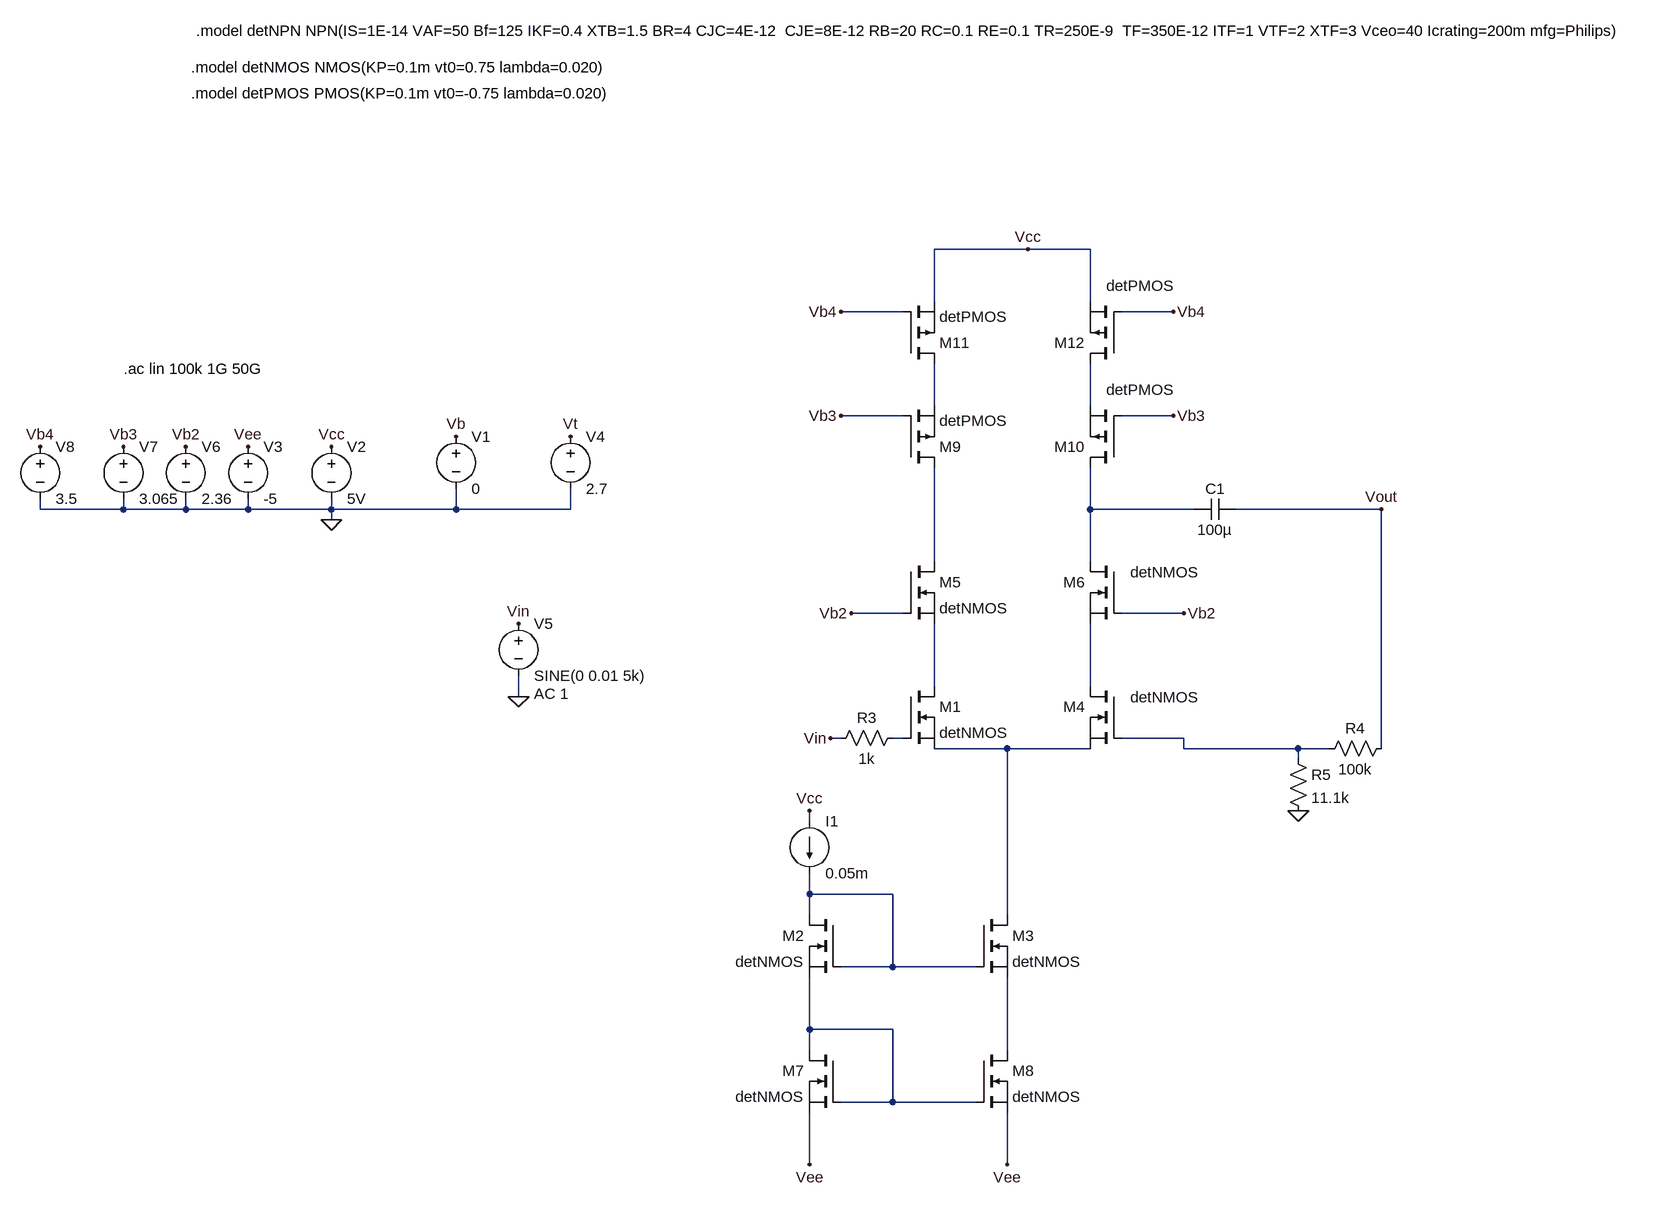
[diagram p0: schematic MOSFETamp.asc]
MOSFETamp.asc, the LTspice schematic file:
Version 4
SHEET 1 1520 2536
WIRE 272 1040 128 1040
WIRE 368 1040 272 1040
WIRE 128 1120 128 1040
WIRE 368 1120 368 1040
WIRE 80 1136 -16 1136
WIRE 496 1136 416 1136
WIRE 128 1280 128 1216
WIRE 368 1280 368 1216
WIRE 80 1296 -16 1296
WIRE 496 1296 416 1296
WIRE -1248 1440 -1248 1424
WIRE -1120 1440 -1120 1424
WIRE -1120 1440 -1248 1440
WIRE -1024 1440 -1024 1424
WIRE -1024 1440 -1120 1440
WIRE -928 1440 -928 1424
WIRE -928 1440 -1024 1440
WIRE -800 1440 -800 1424
WIRE -800 1440 -928 1440
WIRE -608 1440 -608 1408
WIRE -608 1440 -800 1440
WIRE -432 1440 -432 1408
WIRE -432 1440 -608 1440
WIRE 368 1440 368 1376
WIRE 528 1440 368 1440
WIRE 816 1440 592 1440
WIRE -800 1456 -800 1440
WIRE 128 1520 128 1376
WIRE 368 1520 368 1440
WIRE 80 1600 0 1600
WIRE 512 1600 416 1600
WIRE 128 1712 128 1616
WIRE 368 1712 368 1616
WIRE -512 1728 -512 1696
WIRE -16 1792 -32 1792
WIRE 80 1792 64 1792
WIRE 512 1792 416 1792
WIRE 240 1808 128 1808
WIRE 368 1808 240 1808
WIRE 512 1808 512 1792
WIRE 688 1808 512 1808
WIRE 736 1808 688 1808
WIRE 816 1808 816 1440
WIRE 688 1824 688 1808
WIRE -64 1920 -64 1904
WIRE -64 2032 -64 2000
WIRE 64 2032 -64 2032
WIRE -64 2064 -64 2032
WIRE 240 2064 240 1808
WIRE 64 2144 64 2032
WIRE 64 2144 -16 2144
WIRE 192 2144 64 2144
WIRE -64 2240 -64 2160
WIRE 64 2240 -64 2240
WIRE -64 2272 -64 2240
WIRE 240 2272 240 2160
WIRE 64 2352 64 2240
WIRE 64 2352 -16 2352
WIRE 192 2352 64 2352
WIRE -64 2448 -64 2368
WIRE 240 2448 240 2368
FLAG -800 1456 0
FLAG -800 1344 Vcc
FLAG -928 1344 Vee
FLAG -608 1328 Vb
FLAG -64 1904 Vcc
FLAG -432 1328 Vt
FLAG -512 1728 0
FLAG -512 1616 Vin
FLAG 240 2448 Vee
FLAG -64 2448 Vee
FLAG -32 1792 Vin
FLAG 512 1600 Vb2
FLAG 0 1600 Vb2
FLAG -1024 1344 Vb2
FLAG 272 1040 Vcc
FLAG -1120 1344 Vb3
FLAG 496 1296 Vb3
FLAG -16 1296 Vb3
FLAG 496 1136 Vb4
FLAG -16 1136 Vb4
FLAG -1248 1344 Vb4
FLAG 816 1440 Vout
FLAG 688 1904 0
SYMBOL voltage -800 1328 R0
WINDOW 123 0 0 Left 0
WINDOW 39 0 0 Left 0
SYMATTR InstName V2
SYMATTR Value 5V
SYMBOL voltage -928 1328 R0
WINDOW 123 0 0 Left 0
WINDOW 39 0 0 Left 0
SYMATTR InstName V3
SYMATTR Value -5
SYMBOL nmos -16 2064 M0
SYMATTR InstName M2
SYMATTR Value detNMOS
SYMBOL nmos 192 2064 R0
SYMATTR InstName M3
SYMATTR Value detNMOS
SYMBOL nmos 80 1712 R0
SYMATTR InstName M1
SYMATTR Value detNMOS
SYMBOL nmos 416 1712 M0
WINDOW 3 -119 17 Left 2
SYMATTR Value detNMOS
SYMATTR InstName M4
SYMBOL voltage -608 1312 R0
WINDOW 123 0 0 Left 0
WINDOW 39 0 0 Left 0
SYMATTR InstName V1
SYMATTR Value 0
SYMBOL voltage -432 1312 R0
WINDOW 123 0 0 Left 0
WINDOW 39 0 0 Left 0
SYMATTR InstName V4
SYMATTR Value 2.7
SYMBOL voltage -512 1600 R0
WINDOW 123 24 124 Left 2
WINDOW 39 0 0 Left 0
SYMATTR Value2 AC 1
SYMATTR InstName V5
SYMATTR Value SINE(0 0.01 5k)
SYMBOL nmos -16 2272 M0
SYMATTR InstName M7
SYMATTR Value detNMOS
SYMBOL nmos 192 2272 R0
SYMATTR InstName M8
SYMATTR Value detNMOS
SYMBOL current -64 1920 R0
WINDOW 123 0 0 Left 0
WINDOW 39 0 0 Left 0
SYMATTR InstName I1
SYMATTR Value 0.05m
SYMBOL nmos 80 1520 R0
SYMATTR InstName M5
SYMATTR Value detNMOS
SYMBOL nmos 416 1520 M0
WINDOW 3 -119 17 Left 2
SYMATTR Value detNMOS
SYMATTR InstName M6
SYMBOL voltage -1024 1328 R0
WINDOW 123 0 0 Left 0
WINDOW 39 0 0 Left 0
SYMATTR InstName V6
SYMATTR Value 2.36
SYMBOL pmos 80 1376 M180
SYMATTR InstName M9
SYMATTR Value detPMOS
SYMBOL pmos 416 1376 R180
WINDOW 3 -81 120 Left 2
SYMATTR Value detPMOS
SYMATTR InstName M10
SYMBOL voltage -1120 1328 R0
WINDOW 123 0 0 Left 0
WINDOW 39 0 0 Left 0
SYMATTR InstName V7
SYMATTR Value 3.065
SYMBOL pmos 80 1216 M180
SYMATTR InstName M11
SYMATTR Value detPMOS
SYMBOL pmos 416 1216 R180
WINDOW 3 -81 120 Left 2
SYMATTR Value detPMOS
SYMATTR InstName M12
SYMBOL voltage -1248 1328 R0
WINDOW 123 0 0 Left 0
WINDOW 39 0 0 Left 0
SYMATTR InstName V8
SYMATTR Value 3.5
SYMBOL res 80 1776 R90
WINDOW 0 0 56 VBottom 2
WINDOW 3 32 56 VTop 2
SYMATTR InstName R3
SYMATTR Value 1k
SYMBOL res 832 1792 R90
WINDOW 0 0 56 VBottom 2
WINDOW 3 32 56 VTop 2
SYMATTR InstName R4
SYMATTR Value 100k
SYMBOL res 672 1808 R0
SYMATTR InstName R5
SYMATTR Value 11.1k
SYMBOL cap 592 1424 R90
WINDOW 0 0 32 VBottom 2
WINDOW 3 32 32 VTop 2
SYMATTR InstName C1
SYMATTR Value 100µ
TEXT -1008 704 Left 2 !.model detNPN NPN(IS=1E-14 VAF=50 Bf=125 IKF=0.4 XTB=1.5 BR=4 CJC=4E-12  CJE=8E-12 RB=20 RC=0.1 RE=0.1 TR=250E-9  TF=350E-12 ITF=1 VTF=2 XTF=3 Vceo=40 Icrating=200m mfg=Philips)
TEXT -1016 760 Left 2 !.model detNMOS NMOS(KP=0.1m vt0=0.75 lambda=0.020)
TEXT -1120 1224 Left 2 !.ac lin 100k 1G 50G
TEXT -1016 800 Left 2 !.model detPMOS PMOS(KP=0.1m vt0=-0.75 lambda=0.020)

The netlist it stands for:
* MOSFETamp.asc
V2 Vcc 0 5V
V3 Vee 0 -5
M2 N010 N010 N011 N011 detNMOS
M3 N009 N010 N012 N012 detNMOS
M1 N005 N007 N009 N009 detNMOS
M4 N006 N008 N009 N009 detNMOS
V1 Vb 0 0
V4 Vt 0 2.7
V5 Vin 0 SINE(0 0.01 5k) AC 1
M7 N011 N011 Vee Vee detNMOS
M8 N012 N011 Vee Vee detNMOS
I1 Vcc N010 0.05m
M5 N004 Vb2 N005 N005 detNMOS
M6 N003 Vb2 N006 N006 detNMOS
V6 Vb2 0 2.36
M9 N004 Vb3 N001 N001 detPMOS
M10 N003 Vb3 N002 N002 detPMOS
V7 Vb3 0 3.065
M11 N001 Vb4 Vcc Vcc detPMOS
M12 N002 Vb4 Vcc Vcc detPMOS
V8 Vb4 0 3.5
R3 N007 Vin 1k
R4 Vout N008 100k
R5 N008 0 11.1k
C1 Vout N003 100µ
.model NMOS NMOS
.model PMOS PMOS
.lib standard.mos
.model detNPN NPN(IS=1E-14 VAF=50 Bf=125 IKF=0.4 XTB=1.5 BR=4 CJC=4E-12  CJE=8E-12 RB=20 RC=0.1 RE=0.1 TR=250E-9  TF=350E-12 ITF=1 VTF=2 XTF=3 Vceo=40 Icrating=200m mfg=Philips)
.model detNMOS NMOS(KP=0.1m vt0=0.75 lambda=0.020)
.ac lin 100k 1G 50G
.model detPMOS PMOS(KP=0.1m vt0=-0.75 lambda=0.020)
.backanno
.end